# EasyEDA Pro project 2dof-experiment-system.eprj, board PCB1
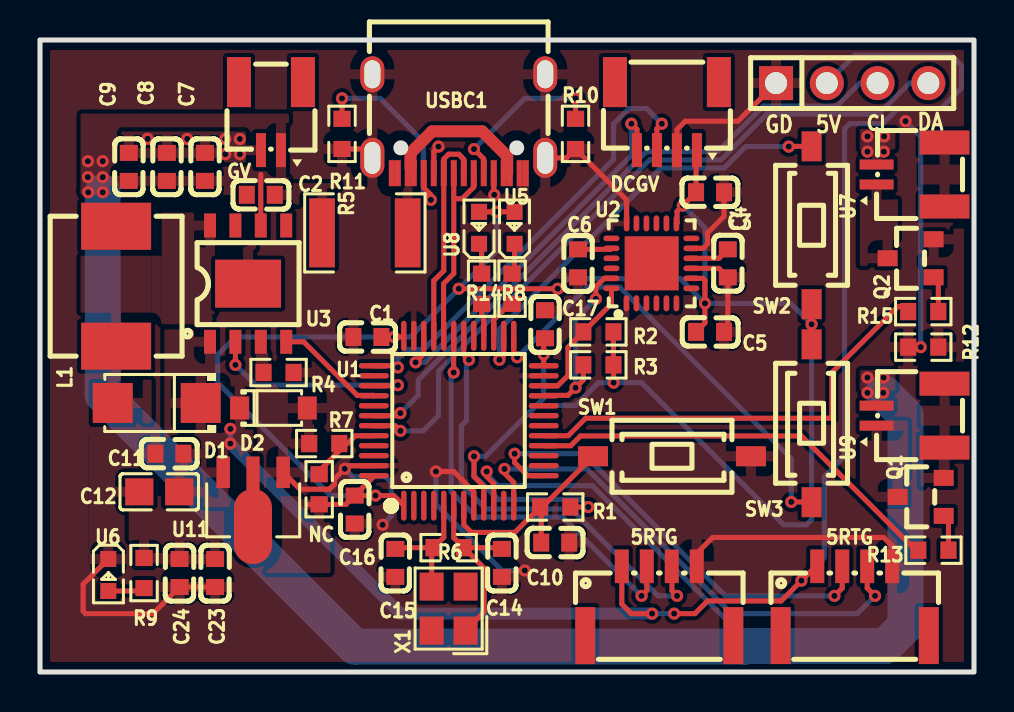
[diagram p3: board, top side]
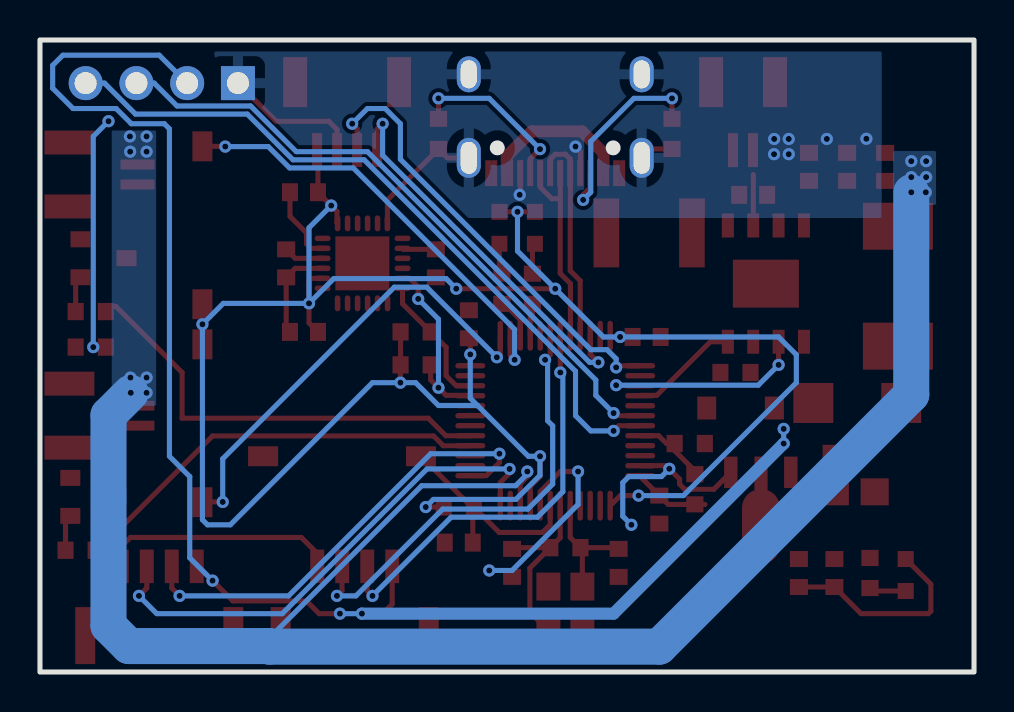
[diagram p4: board, bottom side, seen from below]

Outline 46.74 x 31.62 mm; copper layers: Top Layer, Bottom Layer. Coordinates in mm from the lower left corner of the outline.
Outline path: rectangle 0,31.62 46.74,0
Stack: Top Layer 0.035mm / Dielectric1 1.51mm FR4 er 4.5 / Bottom Layer 0.035mm

## Design rules (mm)
spacing safeClearance (default): track to track 0.152, other pairs 0.152 to 0.3
track width trackWidth (default): min 0.127, default 0.254, max 2.54
differential pair differentialPair (default): width min 0.127, default 0.254, max 2.54; gap min 0.152, default 0.152
via viaSize (default): diameter min 0.5, default 0.61, max 10; hole min 0.3, default 0.305, max 6

## Placement (name value [footprint] x y rotation side)
5RTG  -  [CONN-SMD_4P-P1.25_JS_GH125-S04CCA-00]  40.77 3.56 0 top
5RTG#2  -  [CONN-SMD_4P-P1.25_JS_GH125-S04CCA-00]  30.99 3.56 0 top
C1  10nF  [C0603]  16.38 16.76 180 top
C2  10uF  [C0603]  11.05 23.88 180 top
C3  10nF  [C0603]  33.53 24 0 top
C4  0.1uF  [C0603]  34.42 20.45 270 top
C5  0.1uF  [C0603]  33.53 17.02 180 top
C6  2.2nF  [C0603]  26.92 20.45 90 top
C7  22uF  [C0603]  8.26 25.27 270 top
C8  22uF  [C0603]  6.35 25.27 270 top
C9  100nF  [C0603]  4.45 25.27 270 top
C10  1uF  [C0603]  25.78 6.48 0 top
C11  100nF  [C0603]  6.48 10.92 0 top
C12  47uF  [C0805]  5.97 9.02 0 top
C14  20pF  [C0603]  23.11 5.46 90 top
C15  20pF  [C0603]  17.78 5.46 90 top
C16  10nF  [C0603]  15.75 8.13 270 top
C17  10nF  [C0603]  25.27 17.4 90 top
C23  0.1uF  [C0603]  8.76 4.95 90 top
C24  22uF  [C0603]  6.98 4.95 90 top
CL  PZ254V-11-04P  [HDR-TH_4P-P2.54-V-M]  40.64 29.46 0 top
D1  SS32  [SMA_L4.3-W2.6-LS5.2-RD]  5.84 13.46 180 top
D2  SMFJ6.0A  [SOD-123_L2.8-W1.8-LS3.7-RD]  11.68 13.21 0 top
DCGV  ZX-SH1.0-4PWT  [CONN-SMD_4P-P1.00_MEGASTAR_ZX-SH1.0-4PWT]  31.37 27.81 180 top
GV  WAFER-SH1.0-2PWB  [CONN-SMD_2P-P1.00_XUNPU_WAFER-SH1.0-2PWB]  11.56 27.81 180 top
L1  10uH  [IND-SMD_L7.3-W6.8]  3.81 19.3 90 top
NC  NC  [R0603]  13.97 9.14 270 top
Q1  AO3400  [SOT-23_L2.9-W1.3-P1.90-LS2.4-BR]  44.07 8.76 0 top
Q2  AO3400  [SOT-23_L2.9-W1.3-P1.90-LS2.4-BR]  43.56 20.7 0 top
R1  10kΩ  [R0603]  25.78 8.25 0 top
R2  4.7kΩ  [R0603]  27.94 17.02 0 top
R3  4.7kΩ  [R0603]  27.94 15.37 0 top
R4  1.1kΩ  [R0603]  11.94 14.99 180 top
R5  0.3Ω  [R1812]  16.26 21.97 180 top
R6  1MΩ  [R0603]  20.45 6.22 0 top
R7  100KΩ  [R0603]  14.22 11.43 180 top
R8  1.5kΩ  [R0603]  23.62 19.18 270 top
R9  1.5kΩ  [R0603]  5.21 4.95 270 top
R10  5.1kΩ  [R0603]  26.8 26.92 90 top
R11  5.1kΩ  [R0603]  15.11 26.92 90 top
R12  0Ω  [R0603]  44.2 16.26 0 top
R13  10Ω  [R0603]  44.7 6.1 180 top
R14  1.5kΩ  [R0603]  22.1 19.18 270 top
R15  10Ω  [R0603]  44.2 18.03 180 top
SW1  K2-1107ST-E1SW-06  [SW-SMD_L6.0-W3.6-LS8.0]  31.62 10.8 0 top
SW2  K2-1107ST-E1SW-06  [SW-SMD_L6.0-W3.6-LS8.0]  38.61 22.35 90 top
SW3  K2-1107ST-E1SW-06  [SW-SMD_L6.0-W3.6-LS8.0]  38.61 12.45 270 top
U1  STM32F103C8T6  [LQFP-48_L7.0-W7.0-P0.50-LS9.0-BL]  20.95 12.57 0 top
U2  MPU-6050  [QFN-24_L4.0-W4.0-P0.50-BL-EP2.7]  30.59 20.45 0 top
U3  TP5400  [ESOP-8_L4.9-W3.9-P1.27-LS6.0-BL-EP]  10.41 19.43 0 top
U5  YLED0603B  [LED0603-RD]  23.75 22.22 90 top
U6  YLED0603B  [LED0603-RD]  3.42 4.85 270 top
U7  WAFER-SH1.0-2PWB  [CONN-SMD_2P-P1.00_XUNPU_WAFER-SH1.0-2PWB]  43.56 24.89 90 top
U8  YLED0603B  [LED0603-RD]  21.97 22.22 90 top
U9  WAFER-SH1.0-2PWB  [CONN-SMD_2P-P1.00_XUNPU_WAFER-SH1.0-2PWB]  43.56 12.83 90 top
U11  AMS1117-3.3  [SOT-89_L4.5-W2.5-P1.50-LS4.2-BR]  10.67 8.64 90 top
USBC1  TYPE-C-31-M-12  [USB-C_SMD-TYPE-C-31-M-12]  20.95 27.43 180 top
X1  8MHz  [CRYSTAL-SMD_4P-L3.2-W2.5-BL]  20.45 3.17 90 top

## Footprints (pads in the part's own frame, mm; a bottom-side part is the same pattern mirrored in y, then rotated)
C0603
  rect 0.8x0.9 smd: 1(-0.7,0) 2(0.7,0)
C0805
  rect 1.41x1.35 smd: 1(-1,0) 2(1,0)
CONN-SMD_2P-P1.00_XUNPU_WAFER-SH1.0-2PWB
  rect 0.5x1.7 smd: 1(-0.5,1.7) 2(0.5,1.7)
  rect 1.2x2.5 smd: 3(1.6,-1.7) 4(-1.6,-1.7)
CONN-SMD_4P-P1.00_MEGASTAR_ZX-SH1.0-4PWT
  rect 0.5x1.7 smd: 1(-1.5,1.7) 2(-0.5,1.7) 3(0.5,1.7) 4(1.5,1.7)
  rect 1.2x2.5 smd: 5(2.6,-1.7) 6(-2.6,-1.7)
CONN-SMD_4P-P1.25_JS_GH125-S04CCA-00
  rect 0.7x1.68 smd: 1(-1.875,1.732) 2(-0.625,1.732) 3(0.625,1.732) 4(1.875,1.732)
  rect 1x2.85 smd: 5(3.705,-1.732) 6(-3.705,-1.732)
CRYSTAL-SMD_4P-L3.2-W2.5-BL
  rect 1.4x1.2 smd: 1(-1.1,-0.85) 2(1.1,-0.85) 3(1.1,0.85) 4(-1.1,0.85)
ESOP-8_L4.9-W3.9-P1.27-LS6.0-BL-EP
  rect 0.6x1.2 smd: 1(-1.905,-2.909) 2(-0.635,-2.909) 3(0.635,-2.909) 4(1.905,-2.909) 5(1.905,2.909) 6(0.635,2.909) 7(-0.635,2.909) 8(-1.905,2.909)
  rect 3.3x2.4 smd: 9(0,0)
HDR-TH_4P-P2.54-V-M
  rect 1.7x1.7 hole 1.1: 1(-3.81,0)
  round 1.7 hole 1.1: 2(-1.27,0) 3(1.27,0) 4(3.81,0)
IND-SMD_L7.3-W6.8
  rect 2.35x3.5 smd: 1(-3,0) 2(3,0)
LED0603-RD
  rect 0.8x0.8 smd: 1(-0.799,0) 2(0.799,0)
LQFP-48_L7.0-W7.0-P0.50-LS9.0-BL
  oval 0.27x1.5 smd: 1(-2.75,-4.25) 2(-2.25,-4.25) 3(-1.75,-4.25) 4(-1.25,-4.25) 5(-0.75,-4.25) 6(-0.25,-4.25) 7(0.25,-4.25) 8(0.75,-4.25) 9(1.25,-4.25) 10(1.75,-4.25) 11(2.25,-4.25) 12(2.75,-4.25) 25(2.75,4.25) 26(2.25,4.25) 27(1.75,4.25) 28(1.25,4.25) 29(0.75,4.25) 30(0.25,4.25) 31(-0.25,4.25) 32(-0.75,4.25) 33(-1.25,4.25) 34(-1.75,4.25) 35(-2.25,4.25) 36(-2.75,4.25)
  oval 1.5x0.27 smd: 13(4.25,-2.75) 14(4.25,-2.25) 15(4.25,-1.75) 16(4.25,-1.25) 17(4.25,-0.75) 18(4.25,-0.25) 19(4.25,0.25) 20(4.25,0.75) 21(4.25,1.25) 22(4.25,1.75) 23(4.25,2.25) 24(4.25,2.75) 37(-4.25,2.75) 38(-4.25,2.25) 39(-4.25,1.75) 40(-4.25,1.25) 41(-4.25,0.75) 42(-4.25,0.25) 43(-4.25,-0.25) 44(-4.25,-0.75) 45(-4.25,-1.25) 46(-4.25,-1.75) 47(-4.25,-2.25) 48(-4.25,-2.75)
QFN-24_L4.0-W4.0-P0.50-BL-EP2.7
  oval 0.28x0.8 smd: 1(-1.25,-2) 2(-0.75,-2) 3(-0.25,-2) 4(0.25,-2) 5(0.75,-2) 6(1.25,-2) 13(1.25,2) 14(0.75,2) 15(0.25,2) 16(-0.25,2) 17(-0.75,2) 18(-1.242,2)
  oval 0.8x0.28 smd: 7(2,-1.25) 8(2,-0.75) 9(2,-0.25) 10(2,0.25) 11(2,0.75) 12(2,1.25) 19(-2,1.25) 20(-2,0.75) 21(-2,0.25) 22(-2,-0.25) 23(-2,-0.75) 24(-2,-1.25)
  rect 2.7x2.7 smd: 25(0.013,0)
R0603
  rect 0.806x0.864 smd: 1(-0.753,0) 2(0.753,0)
R1812
  rect 1.282x3.456 smd: 1(-2.141,0) 2(2.141,0)
SMA_L4.3-W2.6-LS5.2-RD
  rect 2x2 smd: 1(-2.2,0) 2(2.2,0)
SOD-123_L2.8-W1.8-LS3.7-RD
  rect 0.95x1.15 smd: 1(-1.692,0) 2(1.692,0)
SOT-23_L2.9-W1.3-P1.90-LS2.4-BR
  rect 1x0.8 smd: 1(1.15,-0.95) 2(1.15,0.95) 3(-1.15,0)
SOT-89_L4.5-W2.5-P1.50-LS4.2-BR
  rect 1.575x0.672 smd: 1(1.356,-1.5) 3(1.356,1.5)
  custom 5.377x1.9 smd: 2(-1.356,0.009)
SW-SMD_L6.0-W3.6-LS8.0
  rect 1.5x1 smd: 1(-3.95,0) 2(3.95,0)
USB-C_SMD-TYPE-C-31-M-12
  oval 1.2x2 hole 0.8x1.6: 0(-4.325,1.706) 1(4.325,1.706)
  oval 1.2x1.8 hole 0.8x1.4: 2(4.325,-2.474) 3(-4.325,-2.474)
  rect 0.3x1.3 smd: A1(-3.35,2.474) A4(-2.55,2.474) A5(-1.25,2.474) A6(-0.25,2.474) A7(0.25,2.474) A8(1.25,2.474) A9(2.55,2.474) A12(3.35,2.474) B1(3.05,2.474) B4(2.25,2.474) B5(1.75,2.474) B6(0.75,2.474) B7(-0.75,2.474) B8(-1.75,2.474) B9(-2.25,2.474) B12(-3.05,2.474)

## Nets
+5V: 5RTG.1 5RTG#2.1 C11.2 C12.2 CL.2 D1.1 D2.1 U3.1 U11.3
+5VUSB: R5.1 USBC1.A4 USBC1.A9 USBC1.B4 USBC1.B9
AGND: Q1.2 Q2.2 R12.2 U7.3 U7.4 U9.3 U9.4
GND: 5RTG.4 5RTG#2.4 C1.2 C3.2 C4.2 C5.1 C6.1 C7.1 C8.1 C9.1 C10.2 C11.1 C12.1 C14.1 C15.1 C16.2 C17.2 C23.1 C24.1 CL.1 D2.2 DCGV.2 GV.2 R4.1 R7.2 R10.1 R11.1 R12.1 SW1.2 U1.8 U1.23 U1.35 U1.47 U2.1 U2.9 U2.11 U2.18 U6.1 U11.1 USBC1.0 USBC1.1 USBC1.2 USBC1.3 USBC1.A1 USBC1.A8 USBC1.A12 USBC1.B1 USBC1.B8 USBC1.B12
VBAT: C7.2 C8.2 C9.2 GV.1 L1.2 U1.10 U3.6 U7.2 U9.2
VCC: C1.1 C3.1 C5.2 C16.1 C17.1 C23.2 C24.2 DCGV.1 NC.2 R1.2 R2.2 R3.2 R9.1 SW2.1 SW3.1 U1.1 U1.9 U1.24 U1.36 U1.48 U2.8 U2.13 U5.2 U8.2 U11.2
DN: U1.32 USBC1.A7 USBC1.B7
DP: U1.33 USBC1.A6 USBC1.B6
IICM_SCL: R3.1 U1.21 U2.23
IICM_SDA: R2.1 U1.22 U2.24
IICS_SCL: CL.3 U1.42
IICS_SDA: CL.4 U1.43
IOCHA: U1.39 U3.2
IOSTB: U1.40 U3.4
LED1: R14.2 U1.28
LED2: R8.2 U1.27
MOTOR1: Q1.3 U9.1
MOTOR2: Q2.3 U7.1
PWM1: R13.2 U1.16
PWM2: R15.2 U1.17
SW1: SW2.2 U1.26
SW2: SW3.2 U1.25
SWCLK: DCGV.3 U1.37
SWDIO: DCGV.4 U1.34
USART1_RX: 5RTG#2.2 U1.31
USART1_TX: 5RTG#2.3 U1.30
USART2_RX: 5RTG.2 U1.13
USART2_TX: 5RTG.3 U1.12
$1N1811: C10.1 R1.1 SW1.1 U1.7
$1N2877: C4.1 U2.10
$1N3300: C6.2 U2.20
$1N5330: R4.2 U3.3
$1N5334: C2.1 R5.2 U3.5
$1N5335: C2.2 U3.7 U3.9
$1N5336: D1.2 L1.1 U3.8
$1N6360: C14.2 R6.2 U1.6 X1.1
$1N6394: C15.2 R6.1 U1.5 X1.3
$1N8882: NC.1 R7.1 U1.44
$1N16382: R9.2 U6.2
$1N16578: R14.1 U8.1
$1N16660: R8.1 U5.1
$1N18554: R11.2 USBC1.B5
$1N18558: R10.2 USBC1.A5
$1N20047: Q1.1 R13.1
$1N20057: Q2.1 R15.1

Pads without a net: 5RTG 5 6; 5RTG#2 5 6; DCGV 5 6; GV 3 4; U1 2 3 4 11 14 15 18 19 20 29 38 41 45 46; U2 2 3 4 5 6 7 12 14 15 16 17 19 21 22 25; X1 2 4

## Via types
v1: diameter 0.61, hole 0.305, Top Layer to Bottom Layer, 72 vias

## Routing (per net, layer and track width the routed paths; a pad name or vN(x,y) marks a point on that pad's centre or on a via; arc(x,y) is an arc through that point)
+5V: length 77.1
  Top Layer w0.254: v1(31.73,2.92) 32.77,2.92 33.4,3.56 37.08,3.56 v1(38.1,4.57) 38.82,5.29 5RTG.1 ; 5RTG#2.1 29.11,3.4 29.59,2.92 v1(30.63,2.92)
  Bottom Layer w0.254: v1(9.52,12.16) v1(9.52,11.43) ; CL.2 40.77,30.86 45.59,30.86 46.1,30.35 46.1,29.21 45.08,28.19 42.93,28.19 42.16,27.43 40.51,27.43 40.26,27.18 40.26,10.8 39.24,9.78 39.24,5.72 v1(38.1,4.57) ; v1(30.63,2.92) v1(31.73,2.92)
  Bottom Layer w0.6: v1(30.63,2.92) 18.03,2.92 v1(9.52,11.43)
+5VUSB: length 7.4
  Top Layer w0.6: 23.38,24.96 23.38,25.81 22.13,27.05 19.62,27.05 18.54,25.97 18.54,25.22
GND: length 81.7
  Top Layer w0.254: U11.1 13.02,9.14 14.48,9.14 14.73,9.4 14.73,9.65 15.4,10.32 U1.47 ; 5RTG.4 42.64,6.31 42.22,6.73 33.66,6.73 32.86,5.94 5RTG#2.4 ; v1(19.94,26.29) 19.71,26.06 USBC1.A8 ; R11.1 16.19,26.17 USBC1.1 ; v1(44.07,16.26) R12.1 ; U2.9 33.97,20.2 C4.2 34.42,17.21 C5.1 ; C23.1 C24.1 5.65,2.92 2.29,2.92 2.16,3.05 2.16,4.39 U6.1 ; DCGV.2 31.87,27.14 32.29,27.56 34.92,27.56 CL.1 ; U1.8 21.7,9.03 20.7,10.03 v1(19.81,10.03) ; v1(22.73,23.88) 22.7,23.9 USBC1.B8 ; USBC1.0 26.35,25.73 R10.1 29.35,23.61 U2.18 ; C3.2 34.23,22.8 33.4,21.97 33.4,21.43 33.17,21.2 U2.11
  Bottom Layer w0.254: v1(19.81,10.03) 19.81,8.38 23.11,5.08 v1(24.26,5.08) ; v1(17.14,7.37) 17.58,7.8 17.58,9.47 17.27,9.78 15.64,9.78 v1(15.25,10.17) ; v1(43.31,27.56) 44.07,26.8 v1(44.07,16.26)
  vias: v1(5.39,26.68) v1(7.37,26.67) v1(9.27,26.67) v1(9.27,25.91) v1(10,26.67) v1(10.01,25.91)
VBAT: length 89.3
  Top Layer w0.254: v1(22.35,10.03) 22.35,9.78 22.7,9.43 U1.10 ; U3.6 11.05,24.89
  Bottom Layer w0.254: 35.25,1.27 35.25,1.7 27.64,9.32 22.94,9.32 22.35,9.91 v1(22.35,10.03)
  Bottom Layer w1.8: v1(42.19,13.97) 43.31,12.86 43.31,2.32 42.29,1.3 35.28,1.3 35.25,1.27 15.75,1.27 3.14,13.88 v1(3.14,24)
  vias: v1(2.4,25.56) v1(2.4,24.76) v1(2.41,24) v1(3.14,25.56) v1(3.14,24.76) v1(41.4,26.8) v1(41.4,26.03) v1(41.4,14.73) v1(41.4,13.97) v1(42.24,26.8) v1(42.22,26.03) v1(42.21,14.73)
VCC: length 121.7
  Top Layer w0.254: C17.1 25.2,16.63 v1(25.2,15.89) U1.24 ; v1(21.72,10.8) 21.72,9.78 22.2,9.29 U1.9 ; C16.1 16.7,9.78 U1.48 ; C16.1 15.3,8.38 13.46,8.38 ; C16.1 v1(16.79,8.83) 17.7,8.83 U1.1 ; U2.13 31.88,22.48 31.88,23.05 v1(32.16,23.34) C3.1 32.83,26.07 DCGV.1 ; v1(27.43,8.25) R1.2 ; R2.2 R3.2 28.7,15.36 v1(28.7,14.48) ; U2.8 33.17,19.7 33.27,19.59 v1(33.27,18.44) 33.27,17.46 C5.2 ; U5.2 v1(22.84,23.02) U8.2 ; 17.08,16.76 v1(17.71,16.76) 18.15,16.76 U1.36 ; SW2.1 v1(38.61,17.4) SW3.1 ; v1(25.91,19.18) v1(20.95,19.18)
  Bottom Layer w0.254: 24.84,13.33 22.3,10.8 v1(21.72,10.8) 21.72,9.84 22.92,8.64 27.05,8.64 v1(27.43,8.25) ; 24.84,13.33 25.2,13.7 v1(25.2,15.89) ; 24.84,13.33 26.8,13.33 27.94,14.48 v1(28.7,14.48) 30.1,14.48 37.21,7.37 38.35,7.37 38.61,7.62 v1(38.61,17.4) 37.56,18.44 v1(33.27,18.44) ; v1(33.27,18.44) 33.27,22.23 v1(32.16,23.34) ; v1(33.27,18.44) 32.03,19.69 26.42,19.69 v1(25.91,19.18) ; v1(16.79,8.83) 14.54,8.83 8.89,14.48 8.89,15.88 9.78,16.76 v1(17.71,16.76) 18.54,16.76 v1(20.95,19.18) 22.84,21.06 v1(22.84,23.02)
DN: length 10.3
  Top Layer w0.254: 20.7,23.68 21.12,23.68 21.7,24.26 USBC1.B7 ; 20.7,23.68 USBC1.A7 ; 20.7,23.68 20.7,19.94 20.19,19.43 20.19,16.83 U1.32
DP: length 11
  Top Layer w0.254: 21.08,25.78 21.08,25.77 ; 21.08,25.78 20.95,25.91 20.45,25.91 20.2,25.67 USBC1.B6 20.2,20.08 19.7,19.58 U1.33 ; 21.08,25.78 21.2,25.66 USBC1.A6
IICM_SCL: length 9.5
  Top Layer w0.254: v1(27.81,18.67) 27.81,19.27 28.24,19.7 U2.23 ; R3.1 27.19,14.61 v1(26.8,14.22) 26.42,13.84 25.23,13.84 U1.21
  Bottom Layer w0.254: 26.8,14.22 26.8,17.65 v1(27.81,18.67)
IICM_SDA: length 6.7
  Top Layer w0.254: U1.22 25.91,14.32 26.42,14.83 26.42,16.25 R2.1 28.59,18.43 U2.24
IICS_SCL: length 32.5
  Top Layer w0.254: v1(18.03,12.95) 17.9,12.82 U1.42
  Bottom Layer w0.254: v1(18.03,12.95) 18.92,13.84 18.92,14.61 30.35,26.03 33.91,26.03 36.2,28.32 39.88,28.32 41.02,29.46 CL.3
IICS_SDA: length 36.4
  Top Layer w0.254: v1(18.03,12.06) 17.78,12.32 U1.43
  Bottom Layer w0.254: CL.4 43.51,29.46 41.96,27.91 36.36,27.91 34.08,25.63 30.52,25.63 19.94,15.05 19.94,12.83 19.18,12.06 v1(18.03,12.06)
IOCHA: length 10.9
  Top Layer w0.254: U1.39 17.88,14.32 v1(17.91,14.35) ; U3.2 v1(9.78,15.37)
  Bottom Layer w0.254: v1(17.91,14.35) 10.8,14.35 v1(9.78,15.37)
IOSTB: length 5.5
  Top Layer w0.254: U3.4 13.2,16.52 15.88,13.84 16.69,13.84 U1.40
LED1: length 1.6
  Top Layer w0.254: R14.2 22.1,17.86 22.2,17.75 U1.28
LED2: length 2
  Top Layer w0.254: U1.27 22.7,17.62 23.5,18.42 R8.2
PWM1: length 21.3
  Top Layer w0.254: R13.2 43.82,6.1 38.1,11.81 27.04,11.81 26.56,11.32 U1.16
PWM2: length 22.3
  Top Layer w0.254: U1.17 26.43,11.82 27.3,12.7 39.62,12.7 39.62,14.99 42.93,18.29 43.44,18.29
SW1: length 22.2
  Top Layer w0.254: v1(22.99,15.62) 23.2,15.84 U1.26 ; v1(37.47,26.29) 37.48,26.3 SW2.2
  Bottom Layer w0.254: v1(22.99,15.62) 22.99,17.14 31.06,25.22 34.25,25.22 35.31,26.29 v1(37.47,26.29)
SW2: length 23.1
  Top Layer w0.254: U1.25 23.7,15.92 v1(23.88,15.75) ; SW3.2 38.6,8.51 v1(37.59,8.51)
  Bottom Layer w0.254: v1(23.88,15.75) 27.38,19.25 29.01,19.25 37.59,10.67 v1(37.59,8.51)
SWCLK: length 22.8
  Top Layer w0.254: v1(31.11,27.43) 30.87,27.19 DCGV.3 ; U1.37 17.82,15.32 v1(17.91,15.24)
  Bottom Layer w0.254: v1(31.11,27.43) 30.35,28.19 29.46,28.19 28.7,27.43 28.7,25.65 19.18,16.13 18.36,16.13 17.91,15.67 v1(17.91,15.24)
SWDIO: length 19.6
  Top Layer w0.254: v1(18.8,15.49) 19.2,15.9 U1.34 ; DCGV.4 29.87,27.15 v1(29.59,27.43)
  Bottom Layer w0.254: v1(18.8,15.49) 19.23,15.49 29.59,25.85 v1(29.59,27.43)
USART1_RX: length 21.1
  Top Layer w0.254: v1(30.1,3.81) 30.36,4.07 5RTG#2.2 ; U1.31 20.7,15.88 20.7,15.88 v1(20.7,14.99)
  Bottom Layer w0.254: v1(20.7,14.99) 20.57,14.86 20.57,9.02 21.84,7.75 26.16,7.75 v1(30.1,3.81)
USART1_TX: length 22.4
  Top Layer w0.254: U1.30 21.2,15.88 v1(21.46,15.62) ; 5RTG#2.3 31.62,5.28 31.62,4.06 v1(31.88,3.81)
  Bottom Layer w0.254: v1(21.46,15.62) 21.34,15.49 21.34,12.57 21.08,12.32 21.08,9.4 22.33,8.15 26.58,8.15 30.93,3.81 v1(31.88,3.81)
USART2_RX: length 22.9
  Top Layer w0.254: 40.14,5.42 40.14,4.2 v1(39.75,3.81) ; v1(23.75,10.92) 23.75,10.48 24.4,9.82 U1.13
  Bottom Layer w0.254: v1(39.75,3.81) 34.3,3.81 27.18,10.92 v1(23.75,10.92)
USART2_TX: length 25.7
  Top Layer w0.254: v1(23.24,10.16) 23.24,9.94 23.7,9.48 U1.12 ; v1(41.78,3.81) 41.39,4.2 41.39,5.42
  Bottom Layer w0.254: v1(41.78,3.81) 40.89,2.92 34.61,2.92 27.37,10.16 v1(23.24,10.16)
$1N1811: length 11
  Top Layer w0.254: C10.1 25.08,8.2 R1.1 ; R1.1 23.76,6.98 21.59,6.98 21.21,7.37 21.21,8.32 U1.7 ; R1.1 25.13,8.25 SW1.1
$1N2877: length 2
  Top Layer w0.254: C4.1 33.97,20.7 U2.10
$1N3300: length 1.7
  Top Layer w0.254: U2.20 28.54,21.15 C6.2
$1N6360: length 9.2
  Top Layer w0.254: U1.6 20.7,6.72 R6.2 ; X1.1 22.23,3 22.23,5.2 R6.2 ; C14.2 23.05,6.22 R6.2
$1N6394: length 6.2
  Top Layer w0.254: R6.1 19.6,6.13 19.6,4.27 ; R6.1 17.84,6.22 C15.2 ; R6.1 20.2,6.73 U1.5
$1N8882: length 3.8
  Top Layer w0.254: NC.1 13.97,10.06 14.98,11.07 R7.1 15.39,11.43 15.78,11.82 U1.44
$1N16382: length 1.8
  Top Layer w0.254: U6.2 5.06,4.05 R9.2
$1N16578: length 1.5
  Top Layer w0.254: R14.1 22.1,21.3 U8.1
$1N16660: length 1.5
  Top Layer w0.254: R8.1 23.75,20.06 U5.1
$1N18554: length 10.5
  Top Layer w0.254: USBC1.B5 19.2,24.23 19.56,23.88 v1(19.56,23.62) ; R11.2 v1(15.11,28.7)
  Bottom Layer w0.254: v1(19.56,23.62) 19.18,24 19.18,26.54 17.02,28.7 v1(15.11,28.7)
$1N18558: length 8.6
  Top Layer w0.254: v1(21.72,26.16) 22.2,25.67 USBC1.A5 ; R10.2 v1(26.8,28.7)
  Bottom Layer w0.254: v1(26.8,28.7) 24.26,28.7 v1(21.72,26.16)
$1N20047: length 1.8
  Top Layer w0.254: R13.1 45.46,7.57 Q1.1
$1N20057: length 1.8
  Top Layer w0.254: Q2.1 44.95,19.51 R15.1

## Copper pours and planes (outline as drawn; the poured copper is in the pictures)
+5V on Top Layer: 6.22,17.14 10.67,17.14 10.67,8.25 6.22,8.25
+5VUSB on Top Layer: 18.16,24.89 18.91,24.89 18.91,22.48 18.16,22.48
AGND on Top Layer: 44.07,27.18 46.48,27.18 46.48,9.27 44.07,9.27
GND on Top Layer: 0,31.62 46.74,31.62 46.74,0 0,0
GND on Top Layer: 11.81,15.49 13.84,15.49 13.84,10.41 11.81,10.41
GND on Top Layer: 2.41,11.81 6.08,11.81 6.08,4.95 2.41,4.95
GND on Top Layer: 4.05,27.05 11.3,27.05 11.3,25.5 4.05,25.5
GND on Bottom Layer: 4.62,31.05 38.01,31.05 38.01,22.72 4.62,22.72
VBAT on Top Layer: 41.02,27.18 42.8,27.18 42.8,25.15 41.02,25.15
VBAT on Top Layer: 2.03,27.94 12.45,27.94 12.45,23.87 2.03,23.87
VBAT on Top Layer: 2,24.19 5.46,24.19 5.46,21.21 2,21.21
VBAT on Top Layer: 41.02,15.11 42.8,15.11 42.8,13.08 41.02,13.08
VBAT on Bottom Layer: 40.92,27.09 43.14,27.09 43.14,13.33 40.92,13.33
VBAT on Bottom Layer: 1.91,26.07 4.05,26.07 4.05,23.37 1.91,23.37
VCC on Top Layer: 4.44,8.8 14.54,8.8 14.54,4.95 4.44,4.95
MOTOR1 on Top Layer: 41.02,12.57 43.43,12.57 43.43,8.38 41.02,8.38
MOTOR2 on Top Layer: 41.02,24.77 42.93,24.77 42.93,20.32 41.02,20.32
$1N5330 on Top Layer: 10.67,17.14 11.65,17.14 11.65,14.53 10.67,14.53
$1N5334 on Top Layer: 11.35,24.46 14.99,24.46 14.99,21.72 11.35,21.72
$1N5335 on Top Layer: 9.4,23.75 10.8,23.75 10.8,19.43 9.4,19.43
$1N5336 on Top Layer: 6.1,22.99 8.76,22.99 8.76,17.91 6.1,17.91
$1N5336 on Top Layer: 2.03,20.83 5.59,20.83 5.59,12.45 2.03,12.45
$1N5336 on Top Layer: 2.16,20.83 8.62,20.83 8.62,17.4 2.16,17.4

## Text on the board
Top Silkscreen Layer: GD | 5V | DA
